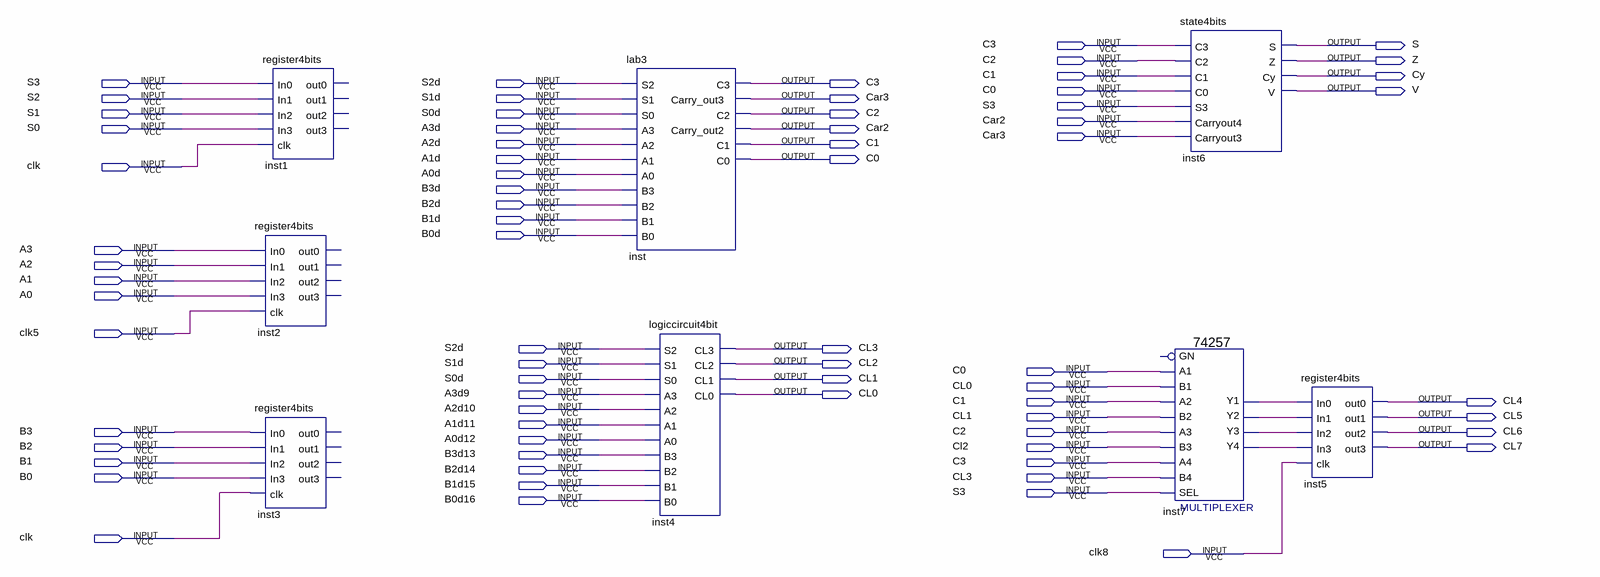
[diagram p0: schematic sheet]
// Quartus schematic ALU.bdf as structural Verilog: 8 symbols, 72 pins
module ALU (
  inout  C3,
  inout  C2,
  inout  C1,
  input  S3,
  input  S2d,
  inout  C0,
  input  S2,
  input  S1d,
  input  S1,
  input  S0d,
  inout  Car2,
  input  S0,
  input  A3d,
  inout  Car3,
  input  A2d,
  input  A1d,
  input  clk,
  input  A0d,
  input  B3d,
  input  B2d,
  input  B1d,
  input  B0d,
  input  A3,
  input  A2,
  input  A1,
  input  A0,
  input  clk5,
  inout  CL0,
  input  A3d9,
  input  A2d10,
  inout  CL1,
  input  A1d11,
  input  B3,
  input  A0d12,
  input  B2,
  inout  Cl2,
  input  B3d13,
  input  B1,
  input  B2d14,
  input  B0,
  inout  CL3,
  input  B1d15,
  input  B0d16,
  input  clk8,
  output S,
  output Z,
  output Cy,
  output V,
  output CL4,
  output CL5,
  output CL6,
  output CL7
);

  wire inst7_y1, inst7_y2, inst7_y3, inst7_y4;

  register4bits inst1 (.In0(S3), .In1(S2), .In2(S1), .In3(S0), .clk(clk));  // open: out0, out1, out2, out3
  register4bits inst2 (.In0(A3), .In1(A2), .In2(A1), .In3(A0), .clk(clk5));  // open: out0, out1, out2, out3
  register4bits inst3 (.In0(B3), .In1(B2), .In2(B1), .In3(B0), .clk(clk));  // open: out0, out1, out2, out3
  lab3 inst (
    .S2(S2d), .S1(S1d), .S0(S0d), .A3(A3d), .A2(A2d), .A1(A1d), .A0(A0d), .B3(B3d), .B2(B2d), .B1(B1d),
    .B0(B0d), .C3(C3), .Carry_out3(Car3), .C2(C2), .Carry_out2(Car2), .C1(C1), .C0(C0));
  logiccircuit4bit inst4 (
    .S2(S2d), .S1(S1d), .S0(S0d), .A3(A3d9), .A2(A2d10), .A1(A1d11), .A0(A0d12), .B3(B3d13), .B2(B2d14),
    .B1(B1d15), .B0(B0d16), .CL3(CL3), .CL2(Cl2), .CL1(CL1), .CL0(CL0));
  \74257  inst7 (
    .B1(CL0), .A1(C0), .B3(Cl2), .A2(C1), .B2(CL1), .A3(C2), .A4(C3), .B4(CL3), .SEL(S3), .Y2(inst7_y2),
    .Y3(inst7_y3), .Y4(inst7_y4), .Y1(inst7_y1));  // open: GN
  state4bits inst6 (
    .C3(C3), .C2(C2), .C1(C1), .C0(C0), .S3(S3), .Carryout4(Car2), .Carryout3(Car3), .S(S), .Z(Z), .Cy(Cy),
    .V(V));
  register4bits inst5 (
    .In0(inst7_y1), .In1(inst7_y2), .In2(inst7_y3), .In3(inst7_y4), .clk(clk8), .out0(CL4), .out1(CL5),
    .out2(CL6), .out3(CL7));
endmodule
